# Altium schematic sheet POE_SI3404.SchDoc: =project_title (part 1 of 3)
size Tabloid; CompanyName: Luxonis Holding; Organization: Luxonis Holding; Address1: 1925 Harmony Park Drive; Address2: Westminster, CO; Address3: 80234; Address4: United States; SheetNumber: 5; SheetTotal: 8
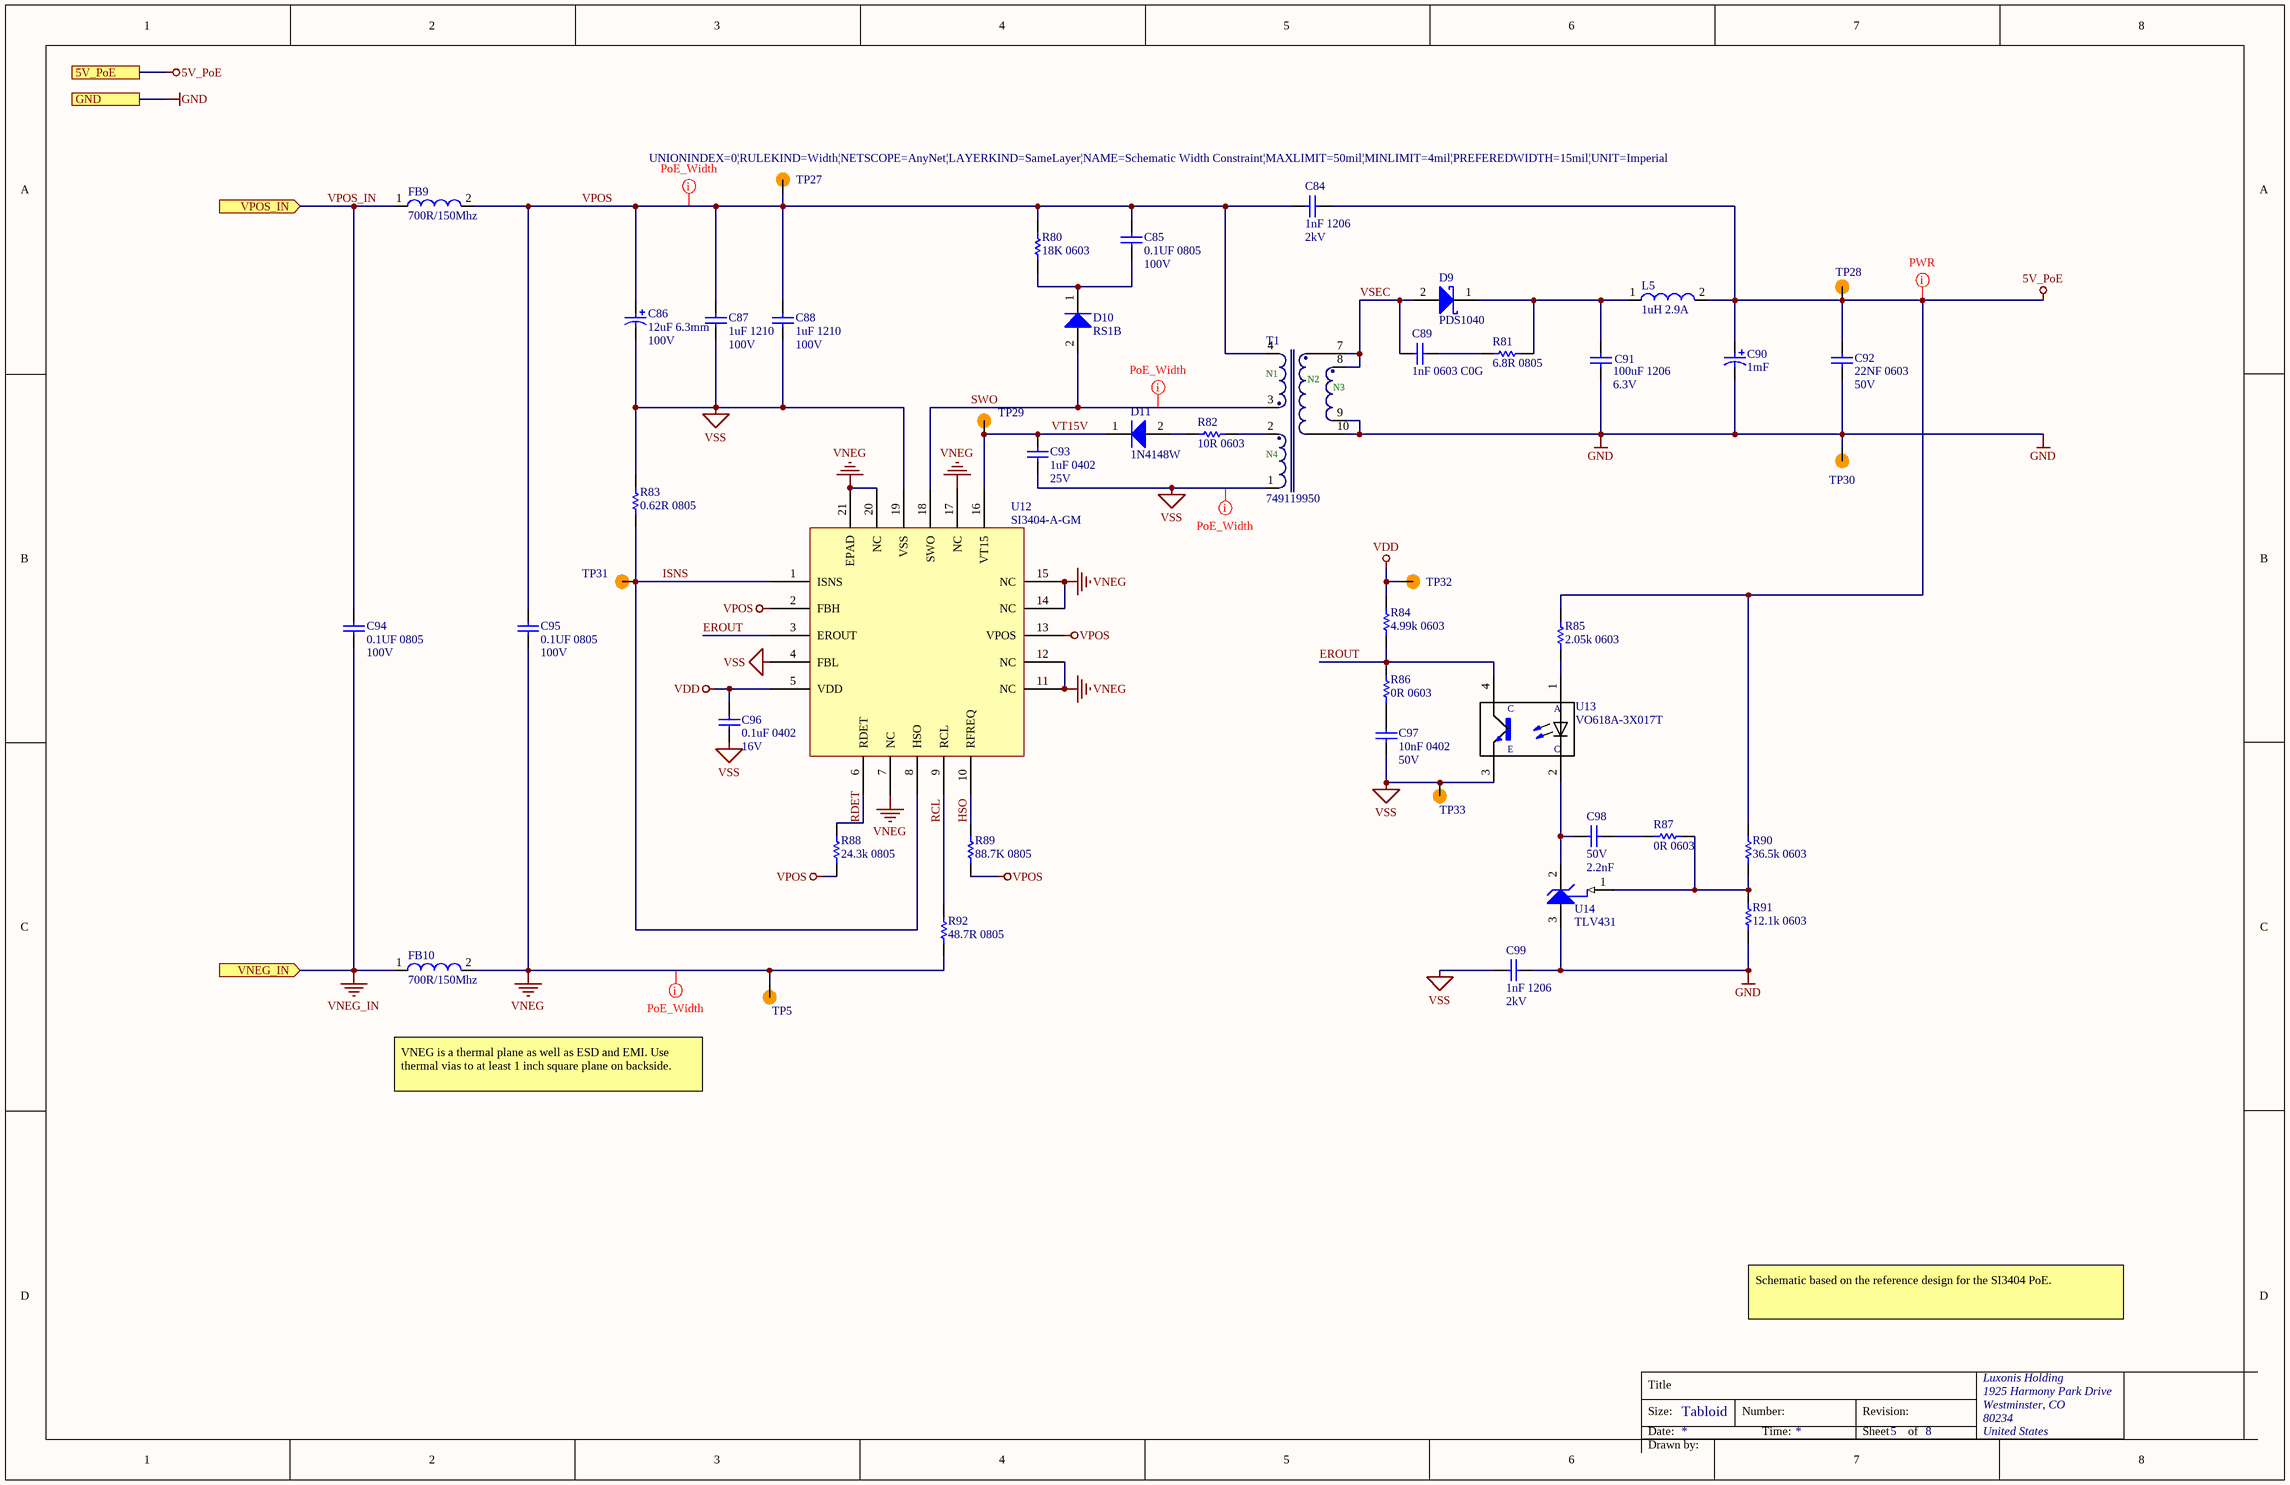
[diagram p0: POE_SI3404.SchDoc]

## Parts
C84  1nF 1206  Voltage Rating (DC): 2kV  [CAPC1206(3216)190_N]
C85  0.1UF 0805  Voltage Rating: 100V  [CAPC0805(2012)145_N]
C86  12uF 6.3mm  Voltage: 100V  [EEU-FC2A120]
C87  1uF 1210  Voltage Rating: 100V  [CAPC1210(3225)280_N]
C88  1uF 1210  Voltage Rating: 100V  [CAPC1210(3225)280_N]
C89  1nF 0603 C0G  [CAPC0603(1608)100_N]
C90  value 1mF  [ECA-0JM102]  (hidden comment: ECA-0JM102)
C91  100uF 1206  Voltage: 6.3V  [CAPC1206(3216)190_N]
C92  22NF 0603  Voltage: 50V  [CAPC0603(1608)100_N]
C93  1uF 0402  Voltage Rating: 25V  [CAPC0402(1005)70_N]
C94  0.1UF 0805  Voltage Rating: 100V  [CAPC0805(2012)145_N]
C95  0.1UF 0805  Voltage Rating: 100V  [CAPC0805(2012)145_N]
C96  0.1uF 0402  Voltage Rating: 16V  [CAPC0402(1005)60_N]
C97  10nF 0402  Voltage Rating: 50V  [CAPC0402(1005)60_N]
C98  value 2.2nF  Voltage Rating: 50V  [CAPC0603(1608)100_N]  (hidden comment: GRM1885C1H222JA01D)
C99  1nF 1206  Voltage Rating (DC): 2kV  [CAPC1206(3216)190_N]
D9  PDS1040  [PDS1040-13]
D10  RS1B  [RS1B]
D11  1N4148W  [1N4148W-7-F]
FB9  700R/150Mhz  [742792040]
FB10  700R/150Mhz  [742792040]
L5  1uH 2.9A  [DO1608C-102MLx]
R80  18K 0603  [RESC0603(1608)_N]
R81  6.8R 0805  [RESC0805(2012)_N]
R82  10R 0603  [RESC0603(1608)_N]
R83  0.62R 0805  [RESC0805(2012)_N]
R84  4.99k 0603  [RESC0603(1608)_N]
R85  2.05k 0603  [RESC0603(1608)_N]
R86  0R 0603  [RESC0603(1608)_N]
R87  0R 0603  [RESC0603(1608)_N]
R88  24.3k 0805  [RESC0805(2012)_N]
R89  88.7K 0805  [RESC0805(2012)_N]
R90  36.5k 0603  [RESC0603(1608)_N]
R91  12.1k 0603  [RESC0603(1608)_N]
R92  48.7R 0805  [RESC0805(2012)_N]
T1  749119950  [749119950]
TP5  TP100_200_NS  [TP075_150_NS]  (value not drawn)  (no BOM)
TP27  TP100_200_NS  [TP075_150_NS]  (value not drawn)  (no BOM)
TP28  TP100_200_NS  [TP075_150_NS]  (value not drawn)  (no BOM)
TP29  TP100_200_NS  [TP075_150_NS]  (value not drawn)  (no BOM)
TP30  TP100_200_NS  [TP075_150_NS]  (value not drawn)  (no BOM)
TP31  TP100_200_NS  [TP075_150_NS]  (value not drawn)  (no BOM)
TP32  TP100_200_NS  [TP075_150_NS]  (value not drawn)  (no BOM)
TP33  TP100_200_NS  [TP075_150_NS]  (value not drawn)  (no BOM)
U12  SI3404-A-GM  [Si3404-A-GM]
U13  VO618A-3X017T  [VO618A-3X017T]
U14  TLV431  [TLV431BCDBZR]

## Ports
5V_PoE, GND, VNEG_IN (in), VPOS_IN (in)

## Nets
5V_PoE: C84.2 C90.1 C92.2 L5.2 R85.2 R90.2 TP28.1 ; port 5V_PoE
GND: C90.2 C91.1 C92.1 C99.2 R91.1 T1.9 T1.10 TP30.1 U14.3(ANODE) ; port GND
VDD: C96.2 R84.2 TP32.1 U12.5(VDD)
VNEG: C95.1 FB10.2 R92.1 TP5.1 U12.7(NC) U12.11(NC) U12.12(NC) U12.14(NC) U12.15(NC) U12.17(NC) U12.20(NC) U12.21(EPAD)
VNEG_IN: C94.1 FB10.1 ; port VNEG_IN
VPOS: C84.1 C85.2 C86.1 C87.2 C88.2 C95.2 FB9.2 R80.2 R88.1 R89.1 T1.4 TP27.1 U12.2(FBH) U12.13(VPOS)
VSS: C86.2 C87.1 C88.1 C93.1 C96.1 C97.1 C99.1 R83.2 T1.1 TP33.1 U12.4(FBL) U12.19(VSS) U13.3(E)
EROUT: R84.1 R86.2 U12.3(EROUT) U13.4(CO)
HSO: R89.2 U12.10(RFREQ)
ISNS: R83.1 TP31.1 U12.1(ISNS) U12.8(HSO)
RCL: R92.2 U12.9(RCL)
RDET: R88.2 U12.6(RDET)
SWO: D10.2(A) T1.3 U12.18(SWO)
VPOS_IN: C94.2 FB9.1 ; port VPOS_IN
VSEC: C89.2 D9.2(A) T1.7 T1.8
VT15V: C93.2 D11.1(K) TP29.1 U12.16(VT15)
NetC85_1: C85.1 D10.1(K) R80.1
NetC89_1: C89.1 R81.1
NetC91_2: C91.2 D9.1(K) L5.1 R81.2
NetC97_2: C97.2 R86.1
NetC98_1: C98.1 U13.2(C) U14.2(CATHODE)
NetC98_2: C98.2 R87.2
NetD11_2: D11.2(A) R82.1
NetR82_2: R82.2 T1.2
NetR85_1: R85.1 U13.1(A)
NetR87_1: R87.1 R90.1 R91.2 U14.1(REF)

## Layout directives
rule Width Constraint [Pref Width = 15mil    Min Width = 4mil    Max Width = 50mil]; net class PoE: SWO, VNEG, VPOS, VSS
net class PWR; Current Rating: 3A: 5V_PoE

## Notes on the sheet
- VNEG is a thermal plane as well as ESD and EMI. Use thermal vias to at least 1 inch square plane on backside.
- Schematic based on the reference design for the SI3404 PoE.
- Title
- Size:
- Date:
- Tabloid
- Number:
- Time:
- Revision:
- Sheet
- of
- Drawn by:
- (in symbol 749119950) N1; N2; N3; N4